# EAGLE design SelfBalance_V3 (EAGLE 8.4.3)
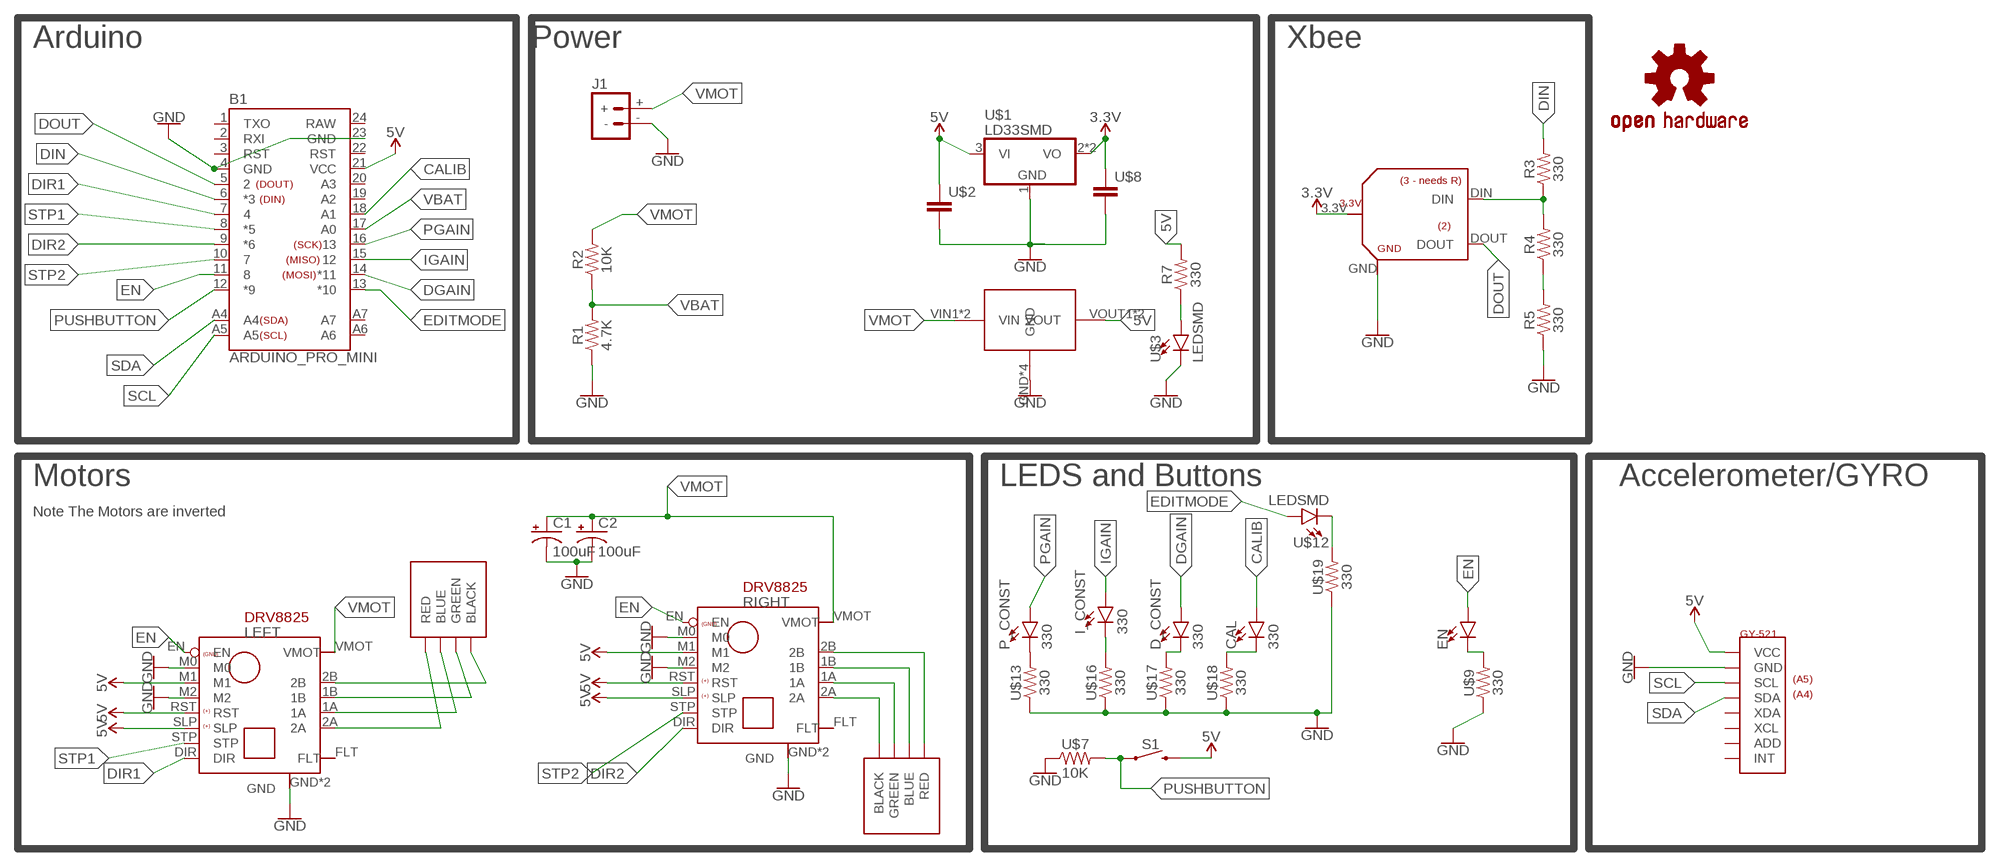
[diagram p0: schematic, sheet 1]

## Parts
B1  ARDUINO_PRO_MINI  [ARDUINO_PRO_MINI]
C1  100uF  CAP_E  [CAP_E]
C2  100uF  CAP_E  [CAP_E]
CAL  330  LEDSMD  [LED_SMD]
D_CONST  330  LEDSMD  [LED_SMD]
EN  LEDSMD  [LED_SMD]
I_CONST  330  LEDSMD  [LED_SMD]
J1  BATTERY_CONNMALE  [DEANS_MALE]
LEFT  DRV8825  [DRV8825]
LOGO1  OSHW-LOGOL  [OSHW-LOGO-L]
P_CONST  330  LEDSMD  [LED_SMD]
R1  4.7K  RESISTORSMD  [R1206]
R2  10K  RESISTORSMD  [R1206]
R3  330  RESISTORSMD  [R1206]
R4  330  RESISTORSMD  [R1206]
R5  330  RESISTORSMD  [R1206]
R7  330  RESISTORSMD  [R1206]
RIGHT  DRV8825  [DRV8825]
S1  PUSH_BUTTON6MM  [BUTTON_6MM]
U$1  LD33SMD  [SOT223]
U$2  CAP_SMCAP  [C1206]
U$3  LEDSMD  [LED_SMD]
U$4  STEPDOWNGREEN  [STEPDOWN]
U$5  GY-521  [GY-521]
U$6  XBEE_BOUT  [XBEE_BOUT]
U$7  10K  RESISTORSMD  [R1206]
U$8  CAP_SMCAP  [C1206]
U$9  330  RESISTORSMD  [R1206]
U$12  LEDSMD  [LED_SMD]
U$13  330  RESISTORSMD  [R1206]
U$14  STEPPER  [2X4]
U$15  STEPPER  [2X4]
U$16  330  RESISTORSMD  [R1206]
U$17  330  RESISTORSMD  [R1206]
U$18  330  RESISTORSMD  [R1206]
U$19  330  RESISTORSMD  [R1206]

## Nets
3.3V: U$1.2(VO) U$1.4(VO) U$6.3.3V U$8.1
5V [POW]: B1.21(VCC) LEFT.M1 LEFT.RST LEFT.SLP R7.2 RIGHT.M1 RIGHT.RST RIGHT.SLP S1.3 U$1.3(VI) U$2.1 U$4.VOUT1(VOUT) U$4.VOUT2(VOUT) U$5.VCC
CALIB: B1.18(A1) CAL.A
DGAIN: B1.14(*11) D_CONST.A
DIN: B1.6(*3) R3.2
DIR1: B1.7 LEFT.DIR
DIR2: B1.9(*6) RIGHT.DIR
DOUT: B1.5 U$6.DOUT
EDITMODE: B1.13(*10) U$12.A
EN: B1.11 EN.A LEFT.EN RIGHT.EN
GND [POW]: B1.4(GND) B1.23(GND) C1.- C2.- J1.- LEFT.GND LEFT.GND2(GND) LEFT.M0 LEFT.M2 R1.1 R5.1 RIGHT.GND RIGHT.GND2(GND) RIGHT.M0 RIGHT.M2 U$1.1(GND) U$2.2 U$3.C U$4.GND U$4.GND2(GND) U$4.GND3(GND) U$4.GND4(GND) U$5.GND U$6.GND U$7.1 U$8.2 U$9.1 U$13.1 U$16.1 U$17.1 U$18.1 U$19.1
IGAIN: B1.15 I_CONST.A
N$1: P_CONST.C U$13.2
N$2 [POW]: LEFT.2B U$14.B1(BLACK) U$14.B2(BLACK)
N$3: R7.1 U$3.A
N$4: I_CONST.C U$16.2
N$5: D_CONST.C U$17.2
N$6: CAL.C U$18.2
N$7 [POW]: LEFT.1A U$14.U1(BLUE) U$14.U2(BLUE)
N$8 [POW]: LEFT.2A U$14.R1(RED) U$14.R2(RED)
N$9 [POW]: RIGHT.2B U$15.R1(RED) U$15.R2(RED)
N$10 [POW]: RIGHT.1B U$15.U1(BLUE) U$15.U2(BLUE)
N$11 [POW]: RIGHT.1A U$15.G1(GREEN) U$15.G2(GREEN)
N$12 [POW]: RIGHT.2A U$15.B1(BLACK) U$15.B2(BLACK)
N$13: R4.1 R5.2
N$14: R3.1 R4.2 U$6.DIN
N$15: U$12.C U$19.2
N$16: EN.C U$9.2
N$18 [POW]: LEFT.1B U$14.G1(GREEN) U$14.G2(GREEN)
PGAIN: B1.16 P_CONST.A
PUSHBUTTON: B1.12(*9) S1.1 U$7.2
SCL: B1.A5 U$5.SCL
SDA: B1.A4 U$5.SDA
STP1: B1.8(*5) LEFT.STP
STP2: B1.10 RIGHT.STP
VBAT: B1.17(A0) R1.2 R2.1
VMOT [POW]: C1.+ C2.+ J1.+ LEFT.VMOT R2.2 RIGHT.VMOT U$4.VIN1(VIN) U$4.VIN2(VIN)
Unconnected: B1.1(TXO) B1.2(RXI) B1.3(RST) B1.19(A2) B1.20(A3) B1.22(RST) B1.A6 B1.A7 LEFT.FLT RIGHT.FLT U$5.ADD U$5.INT U$5.XCL U$5.XDA

## Notes on the sheet
- Arduino | Power | Xbee
- Motors | LEDS and Buttons | Accelerometer/GYRO
- Note The Motors are inverted

## Power pins joined to a net without a drawn wire
RAW: B1.24(RAW)

## Library data of the parts
B1 = Richard_Micros:ARDUINO_PRO_MINI: SparkFun Pro Mini Pro Mini compatible footprint. Dimensions: 0.7 x 1.3" PCB Thickness: 0.8mm SparkFun Products: 3.3V/8MHz <https://www.sparkfun.com/products/11114> 5V/16MHz <https://www.sparkfun.com/products/11113>
C1 C2 = Richard_Components:CAP_E
CAL D_CONST EN I_CONST P_CONST U$3 U$12 = Richard_Components:LED
J1 = Richard_Components:BATTERY_CONN: Battery Connectors Various footprints for battery connections SparkFun Products: Deans Connector -M/F Pair <https://www.sparkfun.com/products/11864>
LEFT RIGHT = Richard_Boards:DRV8825
LOGO1 = SparkFun-Aesthetics:OSHW-LOGO: Open-Source Hardware (OSHW) Logo This logo indicates the piece of hardware it is found on incorporates a OSHW license and/or adheres to the definition of open source hardware found here: http://freedomdefined.org/OSHW
R1-R5 R7 U$7 U$9 U$13 U$16-U$19 = Richard_Components:RESISTOR
S1 = Richard_Components:PUSH_BUTTON: Momentary Switch (Pushbutton) - SPST Normally-open (NO) SPST momentary switches (buttons, pushbuttons). Variants PTH-12MM - 12mm square, through-hole Momentary Pushbutton Switch - 12mm Square <https://www.sparkfun.com/products/9190> (COM-09190) PTH-6.0MM, PTH-6.0MM-KIT - 6.0mm square, through-hole Mini Pushbutton Switch <https://www.sparkfun.com/products/97> (COM-00097) KIT package intended for soldering kit's - only one side of pads' copper is exposed. PTH-RIGHT-ANGLE-KIT - Right-angle, through-hole Right Angle Tactile Button <https://www.sparkfun.com/products/10791> - Used on SparkFun BigTime Watch Kit <https://www.sparkfun.com/products/11734> SMD-12MM - 12mm square, surface-mount Tactile Button - SMD (12mm) <https://www.sparkfun.com/products/12993> (COM-12993) Used on SparkFun PicoBoard <https://www.sparkfun.com/products/11888> SMD-4.5MM - 4.5mm Square Trackball Switch Used on SparkFun Blackberry Trackballer Breakout <https://www.sparkfun.com/products/13169> SMD-4.6MMX2.8MM - 4.60mm x 2.80mm, surface mount Used on SparkFun SAMD21 Mini Breakout <https://www.sparkfun.com/products/13664> SMD-5.2MM, SMD-5.2-REDUNDANT - 5.2mm square, surface-mount Mini Pushbutton Switch - SMD <https://www.sparkfun.com/products/8720> (COM-08720) Used on Arduino Pro Mini <https://www.sparkfun.com/products/11114> REDUNDANT package connects both switch circuits together SMD-6.0X3.5MM - 6.0 x 3.5mm, surface mount Momentary Reset Switch SMD <https://www.sparkfun.com/products/8229> (COM-08229) SMD-6.2MM-TALL - 6.2mm square, surface mount Tactile Button - SMD (6mm) <https://www.sparkfun.com/products/12992> Used on SparkFun Digital Sandbox <https://www.sparkfun.com/products/12651> SMD-RIGHT-ANGLE - Right-angle, surface mount Used on SparkFun Block for Intel® Edison - Arduino <https://www.sparkfun.com/products/13036>; PROD_ID: SWCH-08441; SF_SKU: COM-00097
U$1 = Richard_Components:LD33
U$2 U$8 = Richard_Components:CAP_SM
U$4 = Richard_Boards:STEPDOWN
U$5 = Richard_Boards:GY-521
U$6 = Richard_Boards:XBEE_BOUT
U$14 U$15 = Richard:STEPPER

## Net classes
0 default: width 0.508 mm, clearance 0.051 mm
1 POW: width 1.016 mm, clearance 0.076 mm

## Board
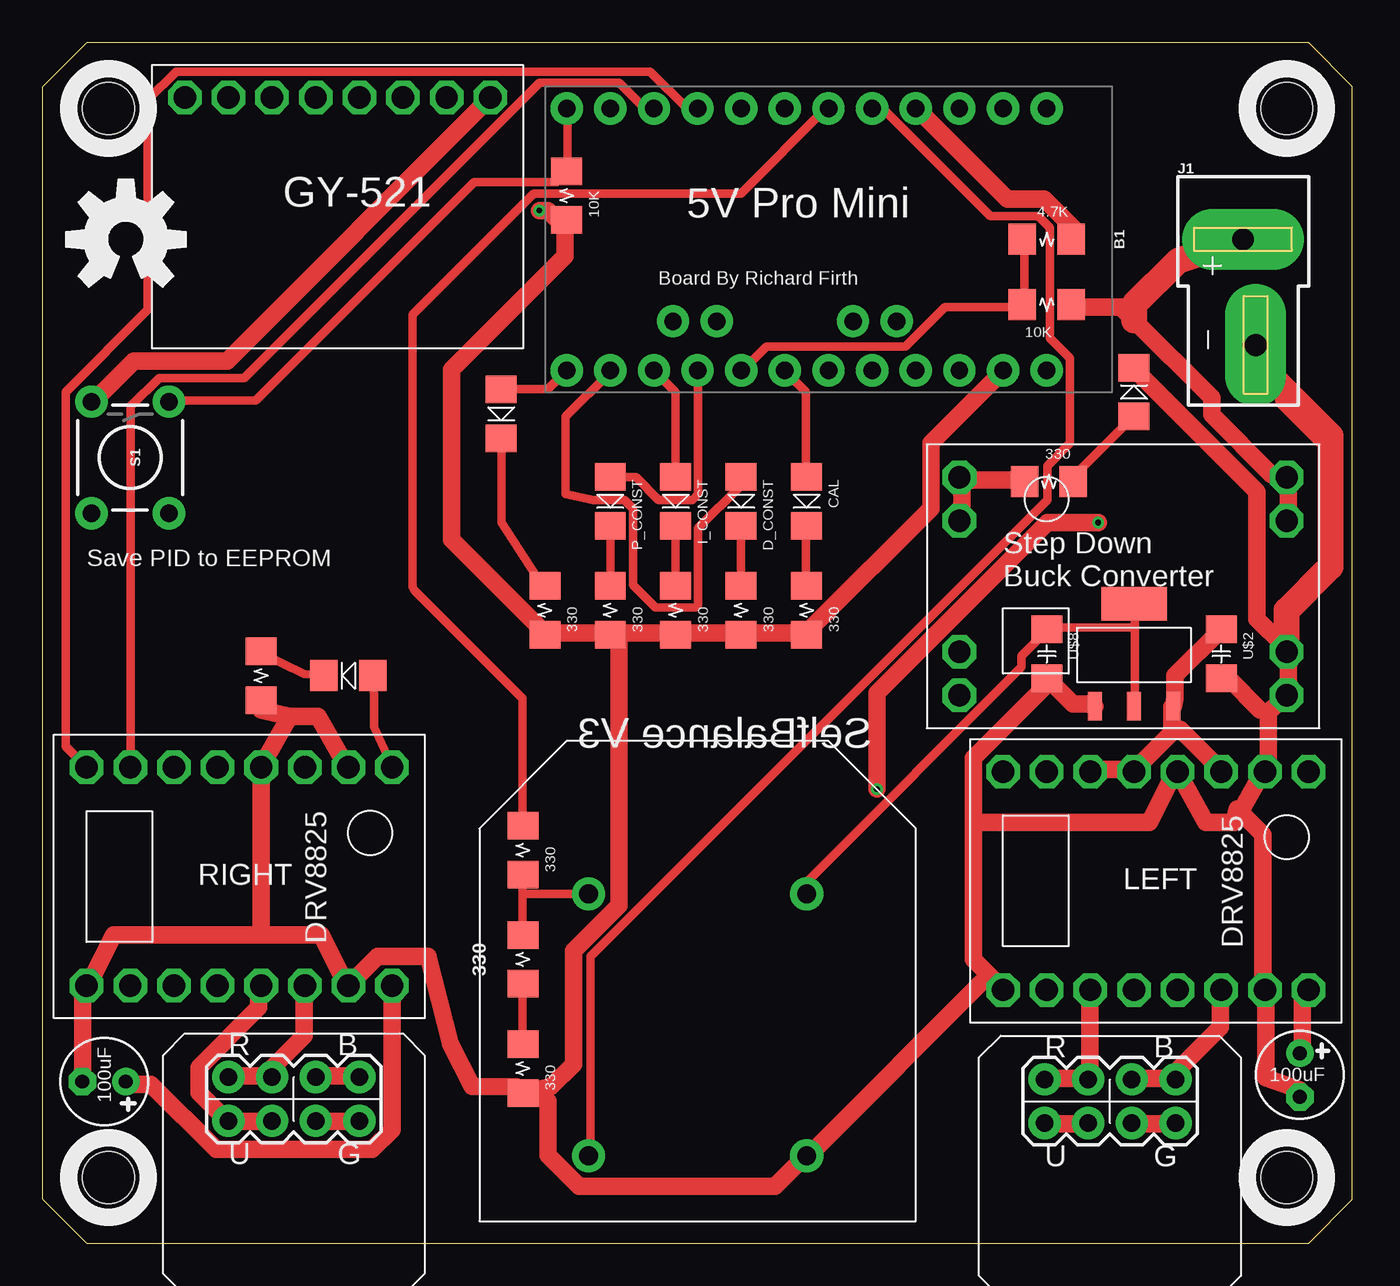
[diagram p1: board, top side]
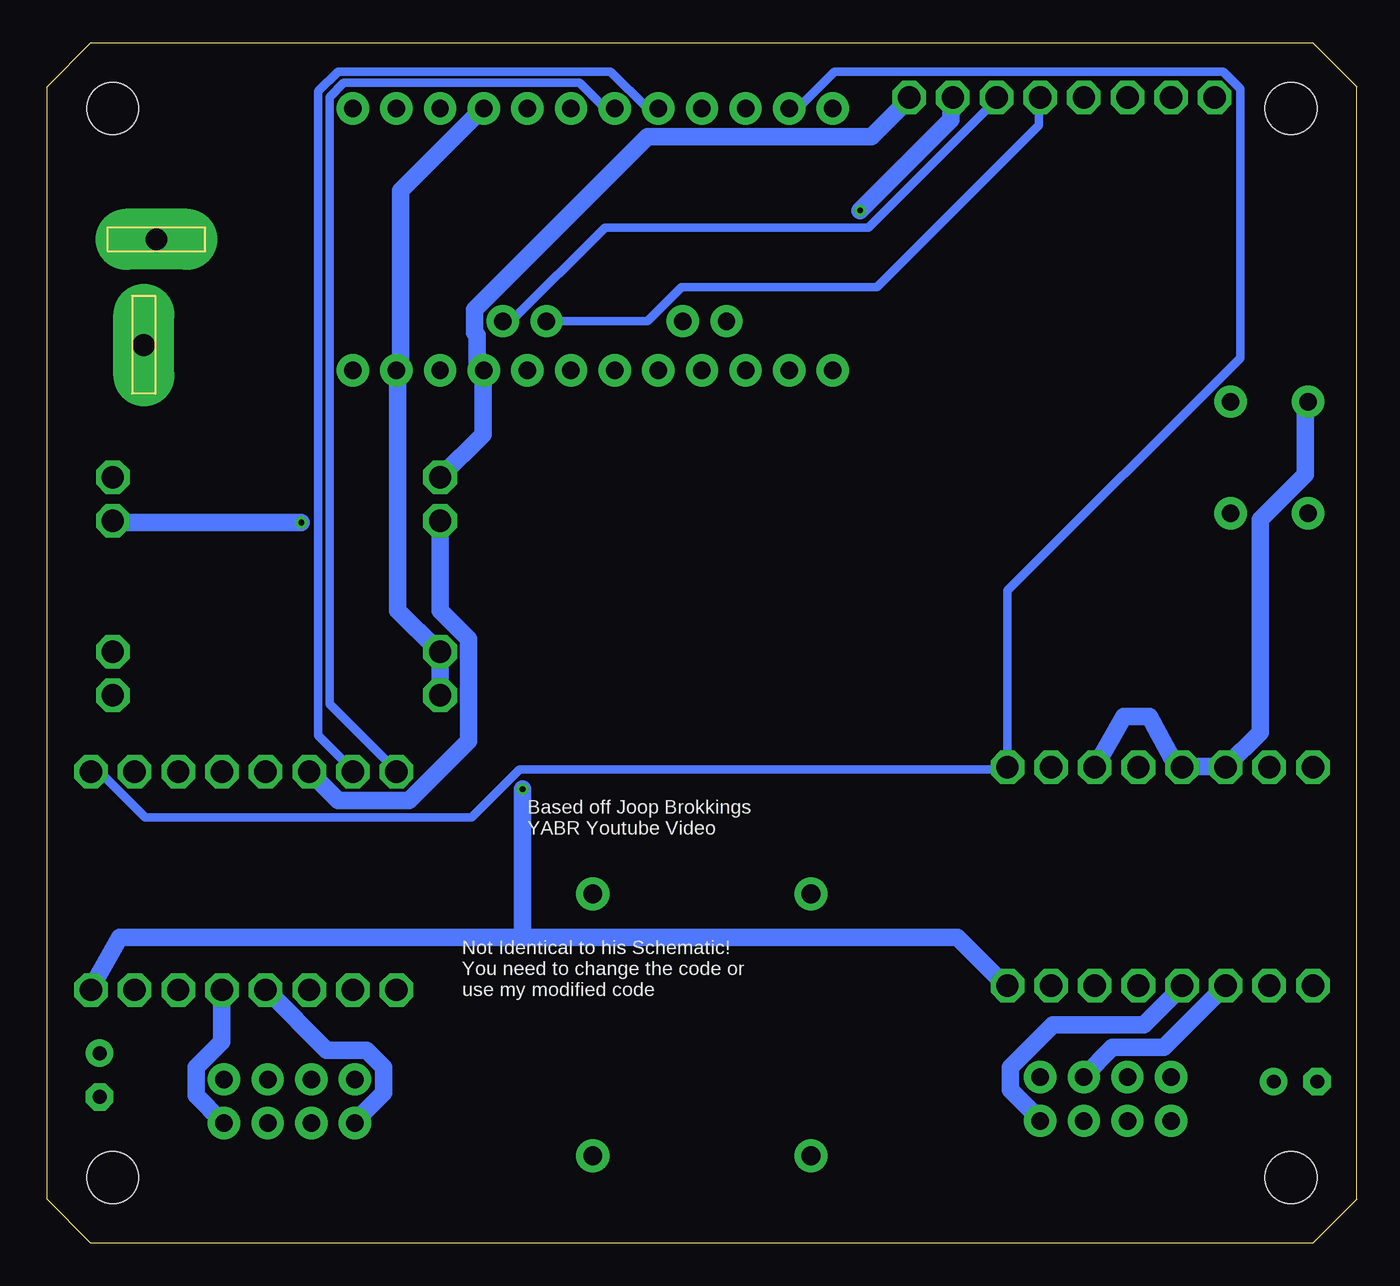
[diagram p2: board, bottom side, seen from below]

Size 76.2 x 69.85 mm. Coordinates in mm from the lower left corner, seen from the top.
Outline: 76.2,2.54 76.2,67.31 73.66,69.85 2.54,69.85 0,67.31 0,2.54 2.54,0 73.66,0 76.2,2.54
Copper layers (1*16): Top 0.0356mm / dielectric 1.5011mm / Bottom 0.0356mm
Design rules "LaenPCBOrder": minimum track width 6mil, minimum drill 13mil, track to track 6mil, track to pad 6mil, pad to pad 6mil, via to via 6mil, smd to smd 6mil, copper to edge 15mil, drill to drill 6mil, minimum pad ring 7mil, minimum via ring 7mil, stop-mask expansion 3mil, vias tented up to drill 0mil, thermal gap 10mil
Holes 3 mm at 72.39,66.04 3.81,66.04 3.81,3.81 72.39,3.81

### Footprints (pad centres in the part's own frame; a part is rotated, then mirrored left to right if it is on the bottom)
ARDUINO_PRO_MINI = drill 1.016 pad 1.88: 1 -7.62,12.7; 2 -7.62,10.16; 3 -7.62,7.62; 4 -7.62,5.08; 5 -7.62,2.54; 6 -7.62,0; 7 -7.62,-2.54; 8 -7.62,-5.08; 9 -7.62,-7.62; 10 -7.62,-10.16; 11 -7.62,-12.7; 12 -7.62,-15.24; 13 7.62,-15.24; 14 7.62,-12.7; 15 7.62,-10.16; 16 7.62,-7.62; 17 7.62,-5.08; 18 7.62,-2.54; 19 7.62,0; 20 7.62,2.54; 21 7.62,5.08; 22 7.62,7.62; 23 7.62,10.16; 24 7.62,12.7; A4 4.763,1.429; A5 4.763,3.969; A6 4.763,-9.049; A7 4.763,-6.509
CAP_E = drill 0.813 pad 1.6: + -1.27,0 | drill 0.813 pad 1.6 octagon: - 1.27,0
LED_SMD = smd 1.6 x 1.803: A -1.422,0; C 1.422,0
DEANS_MALE = drill 1.27 pad 3.556 long: + 0,-1.27; - 0.737,-7.429
DRV8825 = drill 1.3 octagon: 1A 6.35,-1.27; 1B 6.35,1.27; 2A 6.35,-3.81; 2B 6.35,3.81; DIR -6.35,-8.89; EN -6.35,8.89; FLT 6.35,-6.35; GND 6.35,-8.89; GND2 6.35,6.35; M0 -6.35,6.35; M1 -6.35,3.81; M2 -6.35,1.27; RST -6.35,-1.27; SLP -6.35,-3.81; STP -6.35,-6.35; VMOT 6.35,8.89
R1206 = smd 1.6 x 1.803: 1 -1.422,0; 2 1.422,0
BUTTON_6MM = drill 1.016 pad 1.88: 1 -3.251,2.261; 2 3.251,2.261; 3 -3.251,-2.261; 4 3.251,-2.261
SOT223 = smd 0.813 x 1.676: 1 -2.286,-3.048; 2 0,-3.048; 3 2.286,-3.048 | smd 3.81 x 1.93: 4 0,2.921
C1206 = smd 1.6 x 1.803: 1 -1.422,0; 2 1.422,0
STEPDOWN = drill 1.3 octagon: GND -8.89,-6.35; GND2 -8.89,-3.81; GND3 10.16,-3.81; GND4 10.16,-6.35; VIN1 10.16,6.35; VIN2 10.16,3.81; VOUT1 -8.89,3.81; VOUT2 -8.89,6.35
GY-521 = drill 1.3 octagon: ADD -1.27,-6.35; GND -1.27,6.35; INT -1.27,-8.89; SCL -1.27,3.81; SDA -1.27,1.27; VCC -1.27,8.89; XCL -1.27,-1.27; XDA -1.27,-3.81
XBEE_BOUT = drill 1.1 pad 1.93: 3.3V -7.62,6.35; DIN -7.62,-6.35; DOUT 7.62,-6.35; GND 7.62,6.35
2X4 = drill 1.016 pad 1.88: B1 1.27,7.62; B2 3.81,7.62; G1 1.27,5.08; G2 3.81,5.08; R1 -3.81,7.62; R2 -1.27,7.62; U1 -3.81,5.08; U2 -1.27,5.08

### Placement (x,y rotation side)
B1  45.72,58.42 270 top
C1  3.56,9.4 180 top
C2  73.15,9.78 270 top
CAL  44.45,43.18 270 top
D_CONST  40.64,43.18 270 top
EN  17.78,33.02 180 top
I_CONST  36.83,43.18 270 top
J1  69.85,59.69 0 top
LEFT  64.77,21.08 270 top
LOGO1  4.83,58.42 0 top
P_CONST  33.02,43.18 270 top
R1  58.42,58.42 180 top
R2  58.42,54.61 0 top
R3  27.94,22.86 90 top
R4  27.94,16.51 90 top
R5  27.94,10.16 90 top
R7  58.55,44.32 180 top
RIGHT  11.43,21.34 270 top
S1  5.08,45.72 270 top
U$1  63.5,34.29 0 top
U$2  68.58,34.29 270 top
U$3  63.5,49.53 90 top
U$4  62.23,38.23 0 top
U$5  17.14,65.41 270 top
U$6  38.1,12.7 270 top
U$7  30.48,60.96 90 top
U$8  58.42,34.29 270 top
U$9  12.7,33.02 90 top
U$12  26.67,48.26 270 top
U$13  33.02,36.83 90 top
U$14  62.1,1.91 0 top
U$15  14.61,2.03 0 top
U$16  36.83,36.83 90 top
U$17  40.64,36.83 90 top
U$18  44.45,36.83 90 top
U$19  29.21,36.83 90 top

### Tracks (layer width: path | path; a pad name or v marks a point on that pad's centre or on a via)
3.3V
  Top 0.508: 63.56,35.83 63.56,37.15 U$1.4 | 63.56,35.83 63.56,31.37 U$1.2 | 63.56,35.83 58.45,35.83 U$8.1 58.28,35.5 56.96,34.18 56.96,33.52 44.58,21.13 44.58,20.47 U$6.3.3V
5V
  Top 1.016: R7.2 57.12,44.41 53.66,44.41 53.49,44.58 U$4.VOUT2 53.49,43.92 53.49,42.1 U$4.VOUT1 | 65.71,29.88 65.71,29.72 63.56,27.57 LEFT.RST 63.07,27.57 61.09,27.57 LEFT.SLP | 65.71,29.88 65.71,31.2 U$1.3 65.88,31.7 65.88,33.02 68.52,35.66 U$2.1 | LEFT.M1 68.52,27.57 66.2,29.88 65.71,29.88 | U$5.VCC 25.92,66.53 10.73,51.35 5.28,51.35 2.97,49.03 S1.3
  Bottom 1.016: U$4.VOUT2 53.33,44.58 50.85,47.05 50.85,50.69 B1.21 51.18,51.18 51.18,52.83 51.35,53 51.35,54.32 41.27,64.39 28.23,64.39 26.09,66.53 U$5.VCC | U$4.VOUT1 53.33,41.94 53.33,36.82 51.68,35.17 51.68,29.22 55.14,25.76 59.27,25.76 60.92,27.41 LEFT.SLP | S1.3 2.97,48.87 2.97,44.74 5.61,42.1 5.61,29.72 7.59,27.74 RIGHT.SLP 8.09,27.74 10.07,27.74 RIGHT.RST 10.57,27.9 12.05,30.66 13.54,30.66 RIGHT.M1
CALIB
  Top 0.508: CAL.A 44.41,44.74 44.41,49.53 43.26,50.69 B1.18
DGAIN
  Top 0.508: D_CONST.A 40.62,44.58 40.62,44.08 38.14,41.6 38.14,37.15 37.97,36.98 35.66,36.98 34.34,38.3 34.34,42.76 33.85,43.26 32.03,43.26 30.43,43.59 30.43,48.09 33.02,50.69 B1.14
DIN
  Top 0.508: B1.6 45.57,66.04 40.62,61.09 28.56,61.09 21.51,54.04 21.51,38.19 21.63,37.97 27.9,31.7 27.9,24.43 R3.2
DIR1
  Bottom 0.508: B1.7 43.75,66.04 45.24,67.53 58.94,67.53 59.77,66.7 59.77,31.37 55.97,27.57 LEFT.DIR
DIR2
  Top 0.508: B1.9 37.48,66.04 35.33,68.19 7.76,68.19 6.11,66.53 6.11,54.32 1.32,49.53 1.32,28.89 2.48,27.74 RIGHT.DIR
DOUT
  Top 0.508: B1.5 48.87,66.04 55.14,59.77 57.95,59.77 58.61,59.11 58.61,52.67 59.77,51.51 59.77,46.56 58.45,45.24 58.45,43.26 31.86,16.68 31.86,5.12 U$6.DOUT
EDITMODE
  Top 0.508: U$12.A 26.7,49.7 29.39,49.7 30.38,50.69 B1.13
EN
  Top 0.508: EN.A 19.27,31.7 19.27,30.05 20.31,27.74 RIGHT.EN
  Bottom 0.508: B1.11 32.52,66.04 30.38,68.19 7.76,68.19 6.77,67.2 6.77,51.51 20.31,37.97 20.31,27.74 RIGHT.EN 20.47,27.57 48.7,27.57 51.51,24.77 70.5,24.77 73.14,27.41 73.64,27.41 LEFT.EN
GND  (via drill 0.33)
  Top 1.016: U$13.1 33.02,35.5 29.22,35.5 U$19.1 28.89,35.83 23.77,40.95 23.77,50.85 30.38,57.45 30.38,59.44 U$7.1 29.88,59.6 29.39,60.1 v28.89,60.1 | U$13.1 33.52,35.5 36.82,35.5 U$16.1 37.31,35.5 40.62,35.5 U$17.1 41.11,35.5 44.41,35.5 U$18.1 44.74,35.83 51.68,42.76 51.68,46.56 55.8,50.69 B1.23 | B1.4 50.85,66.04 56.13,60.76 58.28,60.76 60.1,58.94 R1.1 | 14.36,30.66 12.71,27.74 RIGHT.M2 12.71,27.24 12.71,17.95 | 14.36,30.66 16.02,30.66 17.67,27.74 RIGHT.M0 | C1.- 2.31,9.41 2.31,14.69 2.48,14.86 RIGHT.GND 2.81,15.35 4.13,17.95 12.71,17.95 | 29.06,8.75 R5.1 | 12.71,17.95 16.18,17.95 17.5,15.35 RIGHT.GND2 17.83,15.02 19.48,16.68 22.4,16.68 23.71,11.56 24.98,9.13 27.57,9.08 R5.1 | U$1.1 61.09,31.37 59.93,31.37 58.45,32.85 U$8.2 58.28,32.36 54.15,28.23 54.15,24.49 | 54.15,24.49 54.15,16.51 55.06,15.6 | 55.06,15.6 55.8,14.86 LEFT.GND | 55.06,15.6 44.58,5.12 U$6.GND 44.08,4.79 42.6,3.3 31.2,3.3 29.39,5.12 29.39,8.26 R5.1 | C2.- 73.14,8.59 73.14,8.91 71.16,9.63 71.16,14.69 LEFT.GND2 70.99,15.19 70.99,23.77 69.51,25.26 69.34,24.49 | 69.34,24.49 67.69,24.49 66.04,27.41 LEFT.M2 65.71,27.08 64.39,24.49 54.15,24.49 | 69.34,24.49 70.99,27.41 LEFT.M0 71.32,27.9 71.32,30.87 | 71.32,30.87 71.98,31.53 U$4.GND4 72.48,32.03 72.48,34.01 U$4.GND3 72.15,34.84 70.66,36.32 70.66,43.75 63.56,50.85 U$3.C | 14.36,30.66 12.71,31.04 12.71,31.53 U$9.1 | U$2.2 68.68,32.85 69.01,32.85 70.83,31.04 71.32,30.87 | R5.1 29.55,9.08 30.87,10.4 30.87,17 33.52,19.65 33.52,35 U$13.1
  Top 1.524: U$4.GND3 72.39,36.83 74.93,39.37 74.93,46.99 | 74.93,46.99 74.59,46.99 72.48,49.1 | J1.- 70.93,50.99 74.93,46.99
  Bottom 1.016: v28.89,60.1 23.61,65.38 23.61,66.53 U$5.GND | U$4.GND 53.33,32.03 53.33,34.01 U$4.GND2 53.49,34.51 55.8,36.82 55.8,50.69 B1.23 55.64,51.18 55.64,61.25 50.85,66.04 B1.4
IGAIN
  Top 0.508: I_CONST.A 36.82,44.74 36.82,49.53 35.66,50.69 B1.15
N$1
  Top 0.508: P_CONST.C U$13.2
N$2
  Top 1.016: U$14.B1 63.4,9.58 65.88,9.58 U$14.B2 66.04,10.07 68.52,12.55 68.52,14.69 LEFT.2B
N$3
  Top 0.508: R7.1 60.1,44.41 60.1,44.74 63.4,48.04 U$3.A
N$4
  Top 0.508: U$16.2 36.82,38.3 36.82,41.6 I_CONST.C
N$5
  Top 0.508: U$17.2 40.62,38.3 40.62,41.6 D_CONST.C
N$6
  Top 0.508: U$18.2 44.41,38.3 44.41,41.6 CAL.C
N$7
  Top 1.016: U$14.U1 58.45,6.93 60.76,6.93 U$14.U2
  Bottom 1.016: LEFT.1A 63.4,14.69 59.93,11.23 57.62,11.23 56.63,10.24 56.63,8.75 58.28,7.1 U$14.U1
N$8
  Top 1.016: U$14.R1 58.45,9.58 60.76,9.58 U$14.R2 60.92,10.07 60.92,14.69 LEFT.2A
N$9
  Top 1.016: U$15.R1 10.9,9.74 13.21,9.74 U$15.R2 13.37,10.24 15.19,12.05 15.19,14.86 RIGHT.2B
N$10
  Top 1.016: U$15.U2 13.21,7.1 10.9,7.1 U$15.U1 10.4,7.43 9.08,8.75 9.08,10.24 12.55,13.7 12.55,14.86 RIGHT.1B
N$11
  Top 1.016: U$15.G1 16.02,7.1 18.33,7.1 U$15.G2
  Bottom 1.016: RIGHT.1A 10.24,14.86 12.38,12.71 17.67,12.71 20.14,10.24 20.14,8.91 18.49,7.26 U$15.G2
N$12
  Top 1.016: U$15.B1 16.02,9.74 18.33,9.74 U$15.B2
  Bottom 1.016: RIGHT.2A 7.76,14.86 11.23,11.39 14.2,11.39 15.85,9.74 U$15.B1
N$13
  Top 0.508: R5.2 27.9,11.72 27.9,15.02 R4.1
N$14
  Top 0.508: 27.9,20.31 27.9,21.3 R3.1 | 27.9,20.31 27.9,18 R4.2 | 27.9,20.31 31.7,20.31 U$6.DIN
N$15
  Top 0.508: U$12.C 26.7,46.72 26.7,41.94 29.06,38.3 U$19.2
N$16
  Top 0.508: U$9.2 12.71,34.34 15.19,33.13 EN.C
N$18
  Top 1.016: U$14.G1 63.4,6.93 65.88,6.93 U$14.G2
  Bottom 1.016: LEFT.1B 66.04,11.72 67.53,10.24 67.53,8.59 66.04,7.1 U$14.G2
PGAIN
  Top 0.508: P_CONST.A 33.02,44.58 34.51,44.58 35.83,43.26 37.81,43.26 38.14,43.59 38.14,50.69 B1.16
PUSHBUTTON
  Top 0.508: B1.12 30.54,66.04 30.54,62.41 U$7.2 30.38,62.24 29.88,61.75 25.09,61.75 12.38,49.03 7.43,49.03 S1.1
SCL
  Bottom 0.508: B1.A5 49.2,53.66 43.75,59.11 28.4,59.11 20.97,66.53 U$5.SCL
SDA
  Bottom 0.508: B1.A4 41.27,53.66 39.29,55.64 27.9,55.64 18.49,65.05 18.49,66.53 U$5.SDA
STP1
  Bottom 0.508: B1.8 41.27,66.04 43.42,68.19 59.27,68.19 60.43,67.03 60.43,29.55 58.45,27.57 LEFT.STP
STP2
  Top 0.508: B1.10 35,66.04 33.52,67.53 28.89,67.53 11.72,50.35 6.77,50.35 5.12,48.7 5.12,27.74 RIGHT.STP
VBAT
  Top 0.508: R1.2 57.12,58.28 57.12,54.65 R2.1 56.79,54.48 52.5,54.48 50.19,52.17 42.1,52.17 40.78,50.85 B1.17
VMOT  (via drill 0.33)
  Top 1.016: U$4.VIN2 72.48,42.1 72.48,44.58 U$4.VIN1 71.98,44.74 71.49,44.74 68.02,48.21 68.02,49.2 63.5,53.72 62.74,54.48 59.93,54.48 R2.2 | C2.+ 73.3,11.06 73.3,14.36 73.64,14.69 LEFT.VMOT | C1.+ 4.95,9.25 6.27,9.25 10.07,5.45 19.15,5.45 20.31,6.6 20.31,14.86 RIGHT.VMOT | v61.42,41.94 58.45,41.94 48.54,32.03 v48.54,26.42
  Top 1.524: J1.+ 66.04,57.15 63.5,54.61 63.5,53.72
  Bottom 1.016: 48.54,17.78 23.23,17.78 20.47,15.02 RIGHT.VMOT | 48.54,17.78 71.98,17.78 73.64,14.86 LEFT.VMOT | v61.42,41.94 72.31,41.94 U$4.VIN2 | 48.54,17.78 v48.54,26.42

### Text on the board
tPlace: 5V Pro Mini | Board By Richard Firth | Save PID to EEPROM | SelfBalance V3 | 100uF
bPlace: Based off Joop Brokkings / YABR Youtube Video | Not Identical to his Schematic! / You need to change the code or / use my modified code